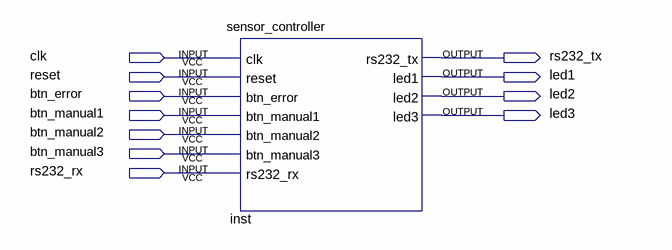
[diagram p0: schematic sheet]
// Quartus schematic projFinal.bdf as structural Verilog: 1 symbols, 11 pins
module projFinal (
  input  clk,
  input  reset,
  input  btn_error,
  input  btn_manual1,
  input  btn_manual2,
  input  btn_manual3,
  input  rs232_rx,
  output rs232_tx,
  output led1,
  output led2,
  output led3
);

  sensor_controller inst (
    .rs232_tx(rs232_tx), .led1(led1), .led2(led2), .led3(led3));  // open: clk, reset, btn_error, btn_manual1, btn_manual2, btn_manual3, rs232_rx
endmodule
